# Altium schematic sheet Sheet1.SchDoc
size A4
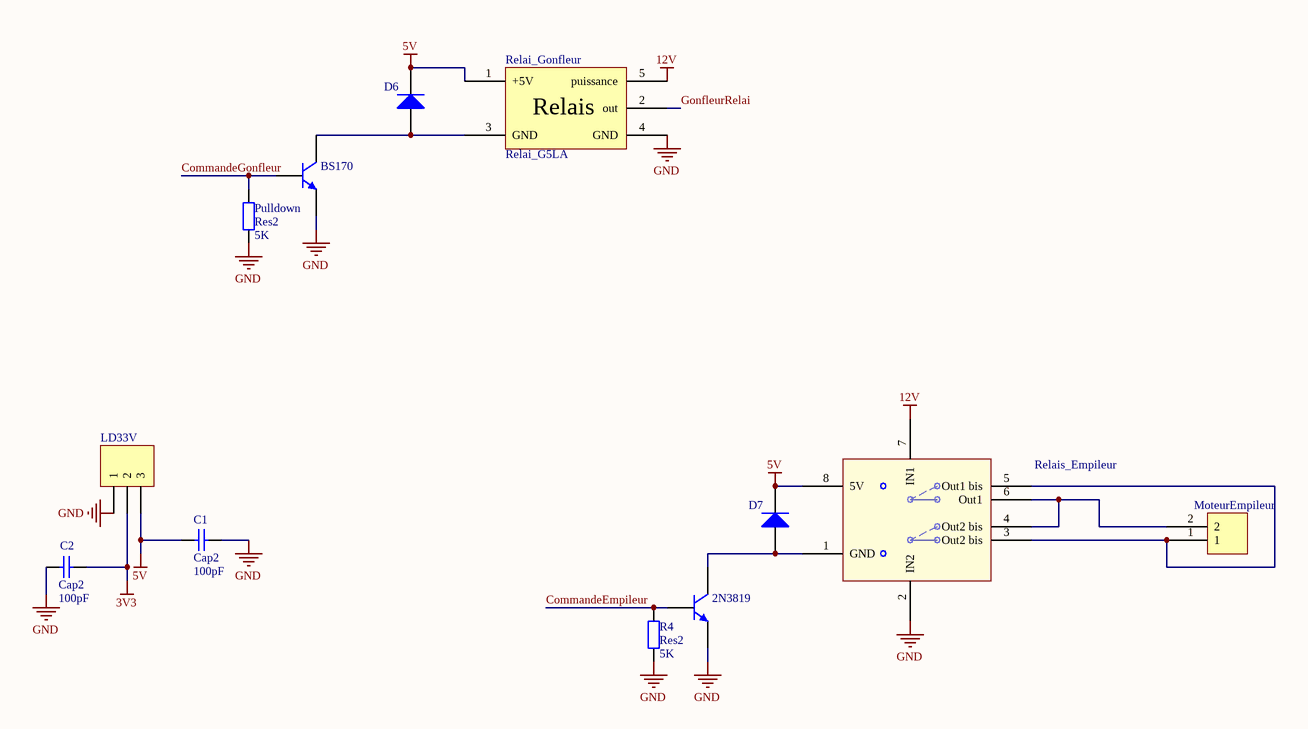
[diagram p0: Sheet1.SchDoc]

## Parts
2N3819  2N3904  [TO92]  (value not drawn)
BS170  2N3904  [TO92]  (value not drawn)
C1  Cap2  value 100pF  [CAPA2]
C2  Cap2  value 100pF  [CAPA2]
D6  Diode 1N4001  [Ddiode]  (value not drawn)
D7  Diode 1N4001  [Ddiode]  (value not drawn)
LD33V  Header 3  [HDR1X3]  (value not drawn)
MoteurEmpileur  Bornier  [Bornier]  (value not drawn)
Pulldown  Res2  value 5K  [res5_1/4W]
R4  Res2  value 5K  [res5_1/4W]
Relai_Gonfleur  Relai_G5LA  [Relai_g5la-1]
Relais_Empileur  Relais_MT2C93401  [Relais_MT2C93401]  (value not drawn)

## Nets
3V3: C2.2 LD33V.2
5V: C1.2 D6.2(K) D7.2(K) LD33V.3 Relai_Gonfleur.1(+5V) Relais_Empileur.8(5V)
12V: Relai_Gonfleur.5(puissance) Relais_Empileur.7(IN1)
GND: 2N3819.1(E) BS170.1(E) C1.1 C2.1 LD33V.1 Pulldown.1 R4.1 Relai_Gonfleur.4(GND) Relais_Empileur.2(IN2)
CommandeEmpileur: 2N3819.2(B) R4.2
CommandeGonfleur: BS170.2(B) Pulldown.2
GonfleurRelai: Relai_Gonfleur.2(out)
Net2N3819_3: 2N3819.3(C) D7.1(A) Relais_Empileur.1(GND)
NetBS170_3: BS170.3(C) D6.1(A) Relai_Gonfleur.3(GND)
NetMoteurEmpileur_1: MoteurEmpileur.1 Relais_Empileur.3(Out2_bis) Relais_Empileur.5(Out1_bis)
NetMoteurEmpileur_2: MoteurEmpileur.2 Relais_Empileur.4(Out2_bis) Relais_Empileur.6(Out1)

## Notes on the sheet
- (in symbol Relai_G5LA) Relais

## Library data of the parts
2N3819 BS170 = 2N3904: NPN General Purpose Amplifier; Published: 8-Jun-2000; LatestRevisionDate: 15-Jan-2003; LatestRevisionNote: PCB Footprint 'BCY-W3/D4.7' replaced; DatasheetDocument: 1997; PackageDocument: Sep-1998; PackageReference: TO-92A; Publisher: Altium Limited; Code_JEDEC: TO-92A; ComponentLink1Description: Manufacturer Link; ComponentLink1URL: http://www.fairchildsemi.com/; ComponentLink2Description: Datasheet; ComponentLink2URL: http://www.fairchildsemi.com/ds/2N%2F2N3904.pdf
C1 C2 = Cap2: Capacitor; Published: 8-Jun-2000; LatestRevisionDate: 17-Jul-2002; LatestRevisionNote: Re-released for DXP Platform.; PackageReference: RAD-0.3; Publisher: Altium Limited
D6 D7 = Diode 1N4001: 1 Amp General Purpose Rectifier; pin to pad: 1>A 2>K; Published: 8-Jun-2000; LatestRevisionDate: 17-Jul-2002; LatestRevisionNote: Re-released for DXP Platform.; DatasheetDocument: 1998; PackageDocument: Aug-1999; PackageReference: DO-41; Publisher: Altium Limited; Code_JEDEC: DO-204-AL; ComponentLink1Description: Manufacturer Link; ComponentLink1URL: http://www.fairchildsemi.com/; ComponentLink2Description: Datasheet; ComponentLink2URL: http://www.fairchildsemi.com/ds/1N%2F1N4001.pdf
LD33V = Header 3: Header, 3-Pin; LatestRevisionDate: 17-Jul-2002; LatestRevisionNote: Re-released for DXP Platform.; Publisher: Altium Limited
MoteurEmpileur = Bornier2
Pulldown R4 = Res2: Resistor; Published: 8-Jun-2000; LatestRevisionDate: 17-Jul-2002; LatestRevisionNote: Re-released for DXP Platform.; PackageReference: AXIAL-0.4; Publisher: Altium Limited